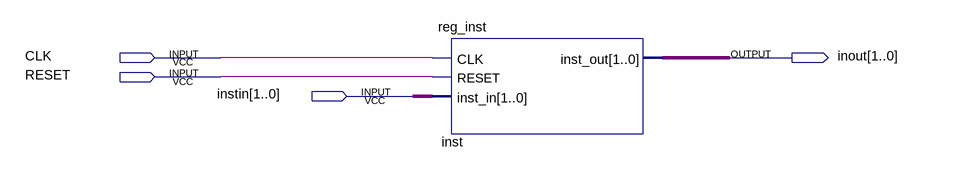
[diagram p0: schematic sheet]
// Quartus schematic regmem.bdf as structural Verilog: 1 symbols, 4 pins
module regmem (
  input  CLK,
  input  RESET,
  input  [1:0] instin,
  output [1:0] \inout 
);

  reg_inst inst (.CLK(CLK), .RESET(RESET), .inst_in(instin), .inst_out(\inout ));
endmodule
